# EAGLE design Design (EAGLE 9.6.2)
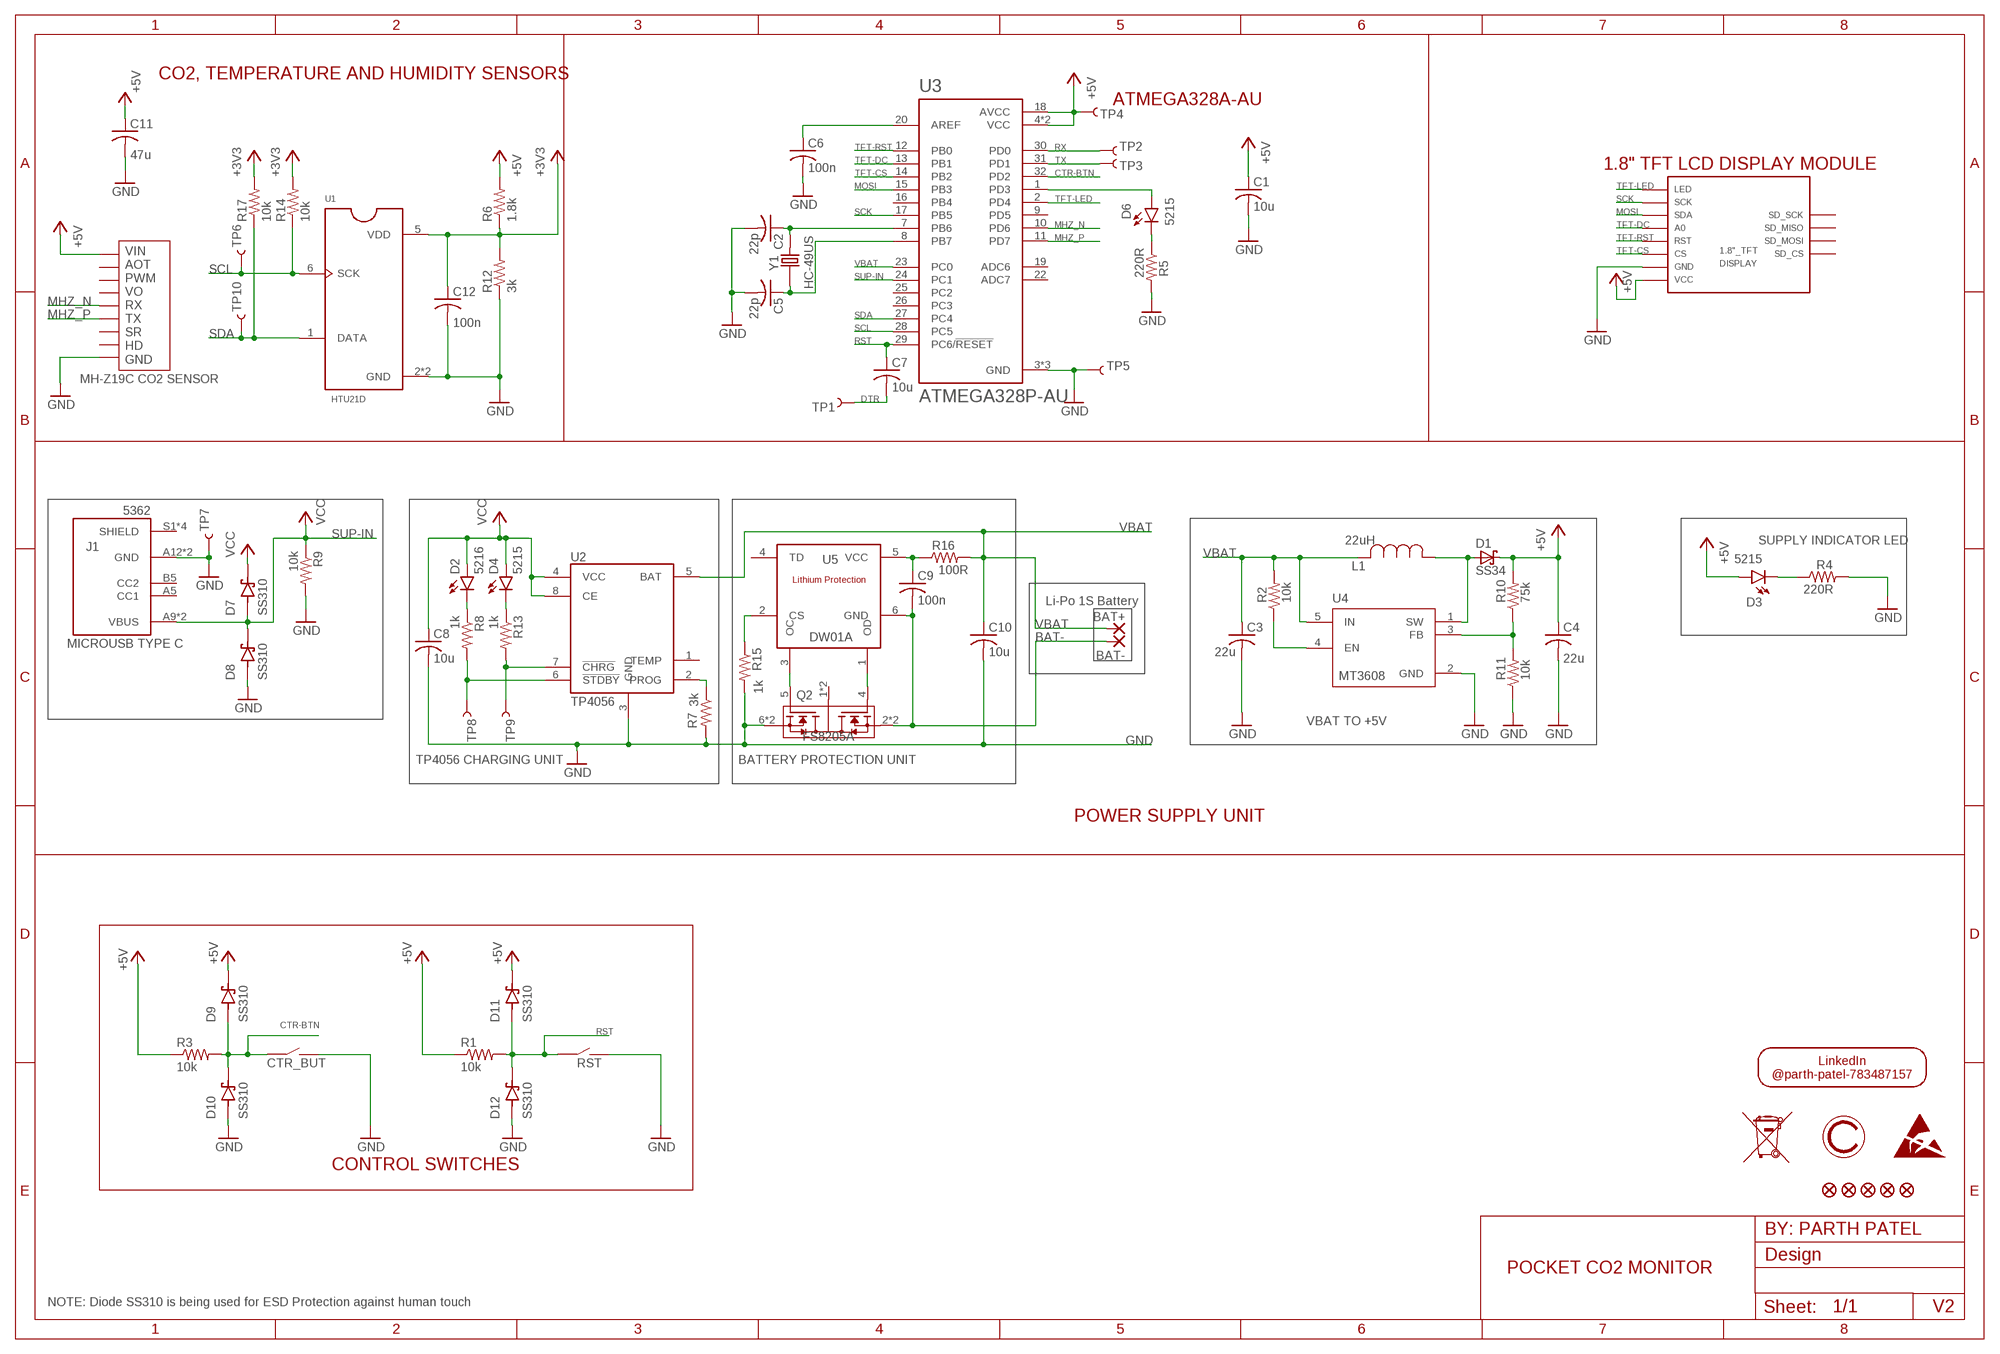
[diagram p0: schematic, sheet 1]

## Parts
BAT+  WIREPADSMD5-2,5  [5-2,5]
BAT-  WIREPADSMD5-2,5  [5-2,5]
C1  10u  C-USC0805  [C0805]
C2  22p  C-USC0805  [C0805]
C3  22u  C-USC0805  [C0805]
C4  22u  C-USC0805  [C0805]
C5  22p  C-USC0805  [C0805]
C6  100n  C-USC0805  [C0805]
C7  10u  C-USC0805  [C0805]
C8  10u  C-USC0805  [C0805]
C9  100n  C-USC0805  [C0805]
C10  10u  C-USC0805  [C0805]
C11  47u  C-USC0805  [C0805]
C12  100n  C-USC0805  [C0805]
CTR_BUT  7058  DIP_3X6MM_SIDE_PRESS_2PIN  [DIP_3X6MM_SIDE_PRESS_2PIN]
D1  SS34  [DO214]
D2  5216  LEDCHIP-LED0603  [CHIP-LED0603]
D3  5215  LEDCHIP-LED0603  [CHIP-LED0603]
D4  5215  LEDCHIP-LED0603  [CHIP-LED0603]
D6  5215  LEDCHIP-LED0603  [CHIP-LED0603]
D7  SS310  [DIOM6859X262N]
D8  SS310  [DIOM6859X262N]
D9  SS310  [DIOM6859X262N]
D10  SS310  [DIOM6859X262N]
D11  SS310  [DIOM6859X262N]
D12  SS310  [DIOM6859X262N]
DISPLAY  1.8"_TFT  [1.8"_TFT]
FID1  FIDUCIAL""  [FIDUCIAL_1MM]
FID2  FIDUCIAL""  [FIDUCIAL_1MM]
FID3  FIDUCIAL""  [FIDUCIAL_1MM]
FID4  FIDUCIAL""  [FIDUCIAL_1MM]
FID5  FIDUCIAL""  [FIDUCIAL_1MM]
J1  5362  6_PIN_TYPE_C_FEMALE  [GCT_USB4125-GF-A-0190_REVA2]
L1  22uH  DR127-221-R  [INDM125125X800N]
Q2  FS8205A  [SOP65P640X120-8N]
R1  10k  R-US_R0805  [R0805]
R2  10k  R-US_R0805  [R0805]
R3  10k  R-US_R0805  [R0805]
R4  220R  R-US_R0805  [R0805]
R5  220R  R-US_R0805  [R0805]
R6  1.8k  R-US_R0805  [R0805]
R7  3k  R-US_R0805  [R0805]
R8  1k  R-US_R0805  [R0805]
R9  10k  R-US_R0805  [R0805]
R10  75k  R-US_R0805  [R0805]
R11  10k  R-US_R0805  [R0805]
R12  3k  R-US_R0805  [R0805]
R13  1k  R-US_R0805  [R0805]
R14  10k  R-US_R0805  [R0805]
R15  1k  R-US_R0805  [R0805]
R16  100R  R-US_R0805  [R0805]
R17  10k  R-US_R0805  [R0805]
RST  7058  DIP_3X6MM_SIDE_PRESS_2PIN  [DIP_3X6MM_SIDE_PRESS_2PIN]
TP1  TEST-POINT3  [PAD.03X.03]
TP2  TEST-POINT3  [PAD.03X.03]
TP3  TEST-POINT3  [PAD.03X.03]
TP4  TEST-POINT3  [PAD.03X.03]
TP5  TEST-POINT3  [PAD.03X.03]
TP6  TEST-POINT3  [PAD.03X.03]
TP7  TEST-POINT3  [PAD.03X.03]
TP8  ~STDBY  TEST-POINT3  [PAD.03X.03]
TP9  ~CHRG  TEST-POINT3  [PAD.03X.03]
TP10  TEST-POINT3  [PAD.03X.03]
U1  HTU21D  [QFN100P300X300X100-7N]
U2  TP4056  [SOP127P600X175-9N]
U3  ATMEGA328P-AU  [QFP80P900X900X120-32N]
U4  MT3608  [SOT95P280X145-6N]
U5  DW01A  [SOT23-6]
U$1  LOGO_17MM  [FOOTPRINT_17MM]
U$2  MH-Z19C  [MH-Z19C]
Y1  HC-49US  ECS-160-20-4X  [XTAL_ECS-160-20-4X]

## Nets
+3V3: C12.1 R6.1 R12.2 R14.2 R17.2 U1.5(VDD)
+5V: C1.1 C4.1 C11.1 D1.C D3.A D9.C(K) D11.C(K) DISPLAY.VCC(+5V) R1.1 R3.1 R6.2 R10.2 TP4.P$1 U3.4(VCC) U3.6(VCC) U3.18(AVCC) U$2.VIN
BAT-: BAT-.1(P) C9.2 Q2.2(S1) Q2.3(S1) U5.6(GND)
CTR-BTN: CTR_BUT.P$1(S1) D9.A D10.C(K) R3.2 U3.32(PD2)
DTR: C7.2 TP1.P$1
GND: C1.2 C2.2 C3.2 C4.2 C5.2 C6.2 C8.2 C10.2 C11.2 C12.2 CTR_BUT.P$2(S2) D8.A D10.A D12.A DISPLAY.GND J1.A12(GND) J1.B12(GND) Q2.6(S2) Q2.7(S2) R4.2 R5.2 R7.2 R9.2 R11.1 R12.1 R15.2 RST.P$2(S2) TP5.P$1 TP7.P$1 U1.2(GND) U1.PAD(GND) U2.3(GND) U3.3(GND) U3.5(GND) U3.21(GND) U4.2(GND) U$2.GND
MHZ_N: U3.10(PD6) U$2.RX
MHZ_P: U3.11(PD7) U$2.TX
MOSI: DISPLAY.SDA U3.15(PB3)
N$2: C5.1 U3.8(PB7) Y1.1
N$3: D3.C R4.1
N$5: R2.1 U4.4(EN)
N$6: C6.1 U3.20(AREF)
N$8: D4.C R13.1
N$9: D2.C R8.1
N$10: C2.1 U3.7(PB6) Y1.2
N$11: D1.A L1.1 U4.1(SW)
N$12: R10.1 R11.2 U4.3(FB)
N$13: D6.C R5.1
N$14: D6.A U3.1(PD3)
N$15: Q2.5(G2) U5.3(OC)
N$16: R13.2 TP9.P$1 U2.7(!CHRG)
N$17: R8.2 TP8.P$1 U2.6(!STDBY)
N$18: R7.1 U2.2(PROG)
N$19: Q2.4(G1) U5.1(OD)
N$20: R15.1 U5.2(CS)
N$21: C9.1 R16.1 U5.5(VCC)
RST: C7.1 D11.A D12.C(K) R1.2 RST.P$1(S1) U3.29(PC6/!RESET)
RX: TP2.P$1 U3.30(PD0)
SCK: DISPLAY.SCK U3.17(PB5)
SCL: R14.1 TP6.P$1 U1.6(SCK) U3.28(PC5)
SDA: R17.1 TP10.P$1 U1.1(DATA) U3.27(PC4)
SUP-IN: D7.A D8.C(K) J1.A9(VBUS) J1.B9(VBUS) R9.1 U3.24(PC1) ; supply symbol labelled VCC
TFT-CS: DISPLAY.CS U3.14(PB2)
TFT-DC: DISPLAY.DC(A0) U3.13(PB1)
TFT-LED: DISPLAY.LED U3.2(PD4)
TFT-RST: DISPLAY.RST U3.12(PB0)
TX: TP3.P$1 U3.31(PD1)
VBAT: BAT+.1(P) C3.1 C10.1 L1.2 R2.2 R16.2 U2.5(BAT) U3.23(PC0) U4.5(IN)
VCC: C8.1 D2.A D4.A D7.C(K) U2.4(VCC) U2.8(CE)
Unconnected: DISPLAY.SD_CS DISPLAY.SD_MISO DISPLAY.SD_MOSI DISPLAY.SD_SCK J1.A5(CC1) J1.B5(CC2) J1.S1(SHIELD) J1.S2(SHIELD) J1.S3(SHIELD) J1.S4(SHIELD) Q2.1(D12) Q2.8(D12) U2.1(TEMP) U3.9(PD5) U3.16(PB4) U3.19(ADC6) U3.22(ADC7) U3.25(PC2) U3.26(PC3) U5.4(TD) U$2.AOT U$2.HD U$2.PWM U$2.SR U$2.VO

## Notes on the sheet
- CO2, TEMPERATURE AND HUMIDITY SENSORS
- ATMEGA328A-AU
- 1.8" TFT LCD DISPLAY MODULE
- SUPPLY INDICATOR LED
- Li-Po 1S Battery
- MICROUSB TYPE C
- VBAT TO +5V
- TP4056 CHARGING UNIT | BATTERY PROTECTION UNIT
- POWER SUPPLY UNIT
- CONTROL SWITCHES
- BY: PARTH PATEL
- POCKET CO2 MONITOR
- NOTE: Diode SS310 is being used for ESD Protection against human touch
- V2

## Library data of the parts
BAT+ BAT- = wirepad:WIREPAD: Wire PAD connect wire on PCB
C1-C12 = rcl:C-US: CAPACITOR, American symbol; SPICEPREFIX: C
CTR_BUT RST = Switches:DIP_3X6MM_SIDE_PRESS_2PIN
D1 = SS34:SS34: SS34 Schottky diode http://www.vishay.com/docs/88751/ss32.pdf Check availability <https://pricing.snapeda.com/parts/SS34/ON%20Semiconductor/view-part?ref=eda>; AVAILABILITY: In Stock; DESCRIPTION: Diode Schottky 40 V 3A Surface Mount SMC (DO-214AB); MF: ON Semiconductor; MP: SS34; PACKAGE: SMC-2 ON Semiconductor; PRICE: None; PURCHASE-URL: https://pricing.snapeda.com/search/part/SS34/?ref=eda
D2-D4 D6 = led:LED: LED OSRAM: - CHIPLED LG R971, LG N971, LY N971, LG Q971, LY Q971, LO R971, LY R971 LH N974, LH R974 LS Q976, LO Q976, LY Q976 LO Q996 - Hyper CHIPLED LW Q18S LB Q993, LB Q99A, LB R99A - SideLED LS A670, LO A670, LY A670, LG A670, LP A670 LB A673, LV A673, LT A673, LW A673 LH A674 LY A675 LS A676, LA A676, LO A676, LY A676, LW A676 LS A679, LY A679, LG A679 - Hyper Micro SIDELED® LS Y876, LA Y876, LO Y876, LY Y876 LT Y87S - SmartLED LW L88C, LW L88S LB L89C, LB L89S, LG L890 LS L89K, LO L89K, LY L89K LS L896, LA L896, LO L896, LY L896 - TOPLED LS T670, LO T670, LY T670, LG T670, LP T670 LSG T670, LSP T670, LSY T670, LOP T670, LYG T670 LG T671, LOG T671, LSG T671 LB T673, LV T673, LT T673, LW T673 LH T674 LS T676, LA T676, LO T676, LY T676, LB T676, LH T676, LSB T676, LW T676 LB T67C, LV T67C, LT T67C, LS T67K, LO T67K, LY T67K, LW E67C LS E67B, LA E67B, LO E67B, LY E67B, LB E67C, LV E67C, LT E67C LW T67C LS T679, LY T679, LG T679 LS T770, LO T770, LY T770, LG T770, LP T770 LB T773, LV T773, LT T773, LW T773 LH T774 LS E675, LA E675, LY E675, LS T675 LS T776, LA T776, LO T776, LY T776, LB T776 LHGB T686 LT T68C, LB T68C - Hyper Mini TOPLED® LB M676 - Mini TOPLED Santana® LG M470 LS M47K, LO M47K, LY M47K Source: http://www.osram.convergy.de LUXEON: - LUMILED® LXK2-PW12-R00, LXK2-PW12-S00, LXK2-PW14-U00, LXK2-PW14-V00 LXK2-PM12-R00, LXK2-PM12-S00, LXK2-PM14-U00 LXK2-PE12-Q00, LXK2-PE12-R00, LXK2-PE12-S00, LXK2-PE14-T00, LXK2-PE14-U00 LXK2-PB12-K00, LXK2-PB12-L00, LXK2-PB12-M00, LXK2-PB14-N00, LXK2-PB14-P00, LXK2-PB14-Q00 LXK2-PR12-L00, LXK2-PR12-M00, LXK2-PR14-Q00, LXK2-PR14-R00 LXK2-PD12-Q00, LXK2-PD12-R00, LXK2-PD12-S00 LXK2-PH12-R00, LXK2-PH12-S00 LXK2-PL12-P00, LXK2-PL12-Q00, LXK2-PL12-R00 Source: www.luxeon.com KINGBRIGHT: KA-3528ASYC Source: www.kingbright.com
D7-D12 = Schottky SS310:SS310: Check availability <https://pricing.snapeda.com/parts/SS310/Taiwan%20Semiconductor/view-part?ref=eda>; AVAILABILITY: In Stock; DESCRIPTION: 3A, 100V, Schottky Rectifier; MF: Taiwan Semiconductor; MP: SS310; PACKAGE: SMC-2 Taiwan Semiconductor; PRICE: None; PURCHASE-URL: https://pricing.snapeda.com/search/part/SS310/?ref=eda
DISPLAY = TFT & OLED Display:1.8"_TFT
FID1-FID5 = Airquality_Sensor:FIDUCIAL: Fiducial Alignment Points Various fiducial points for machine vision alignment.; BOM: EXCLUDE
J1 = MicroUSB Type C Socket:6_PIN_TYPE_C_FEMALE: Check availability <https://pricing.snapeda.com/parts/USB4125-GF-A-0190/Global%20Connector%20Technology/view-part?ref=eda>; AVAILABILITY: In Stock; DESCRIPTION: USB-C (USB TYPE-C) USB 2.0 Receptacle Connector 24 (6+18 Dummy) Position Surface Mount, Right Angle; Through Hole; MF: Global Connector Technology; MP: USB4125-GF-A-0190; PACKAGE: None; PRICE: None; PURCHASE-URL: https://pricing.snapeda.com/search/part/USB4125-GF-A-0190/?ref=eda
L1 = SMD 12mm Inductor:DR127-221-R: POWER INDUCTOR Check availability <https://pricing.snapeda.com/parts/DR127-221-R/Eaton/view-part?ref=eda>; AVAILABILITY: In Stock; DESCRIPTION: Inductor Power Shielded Drum Core 221.5uH/220uH 20% 100KHz Ferrite 1.29A 376mOhm DCR T/R; MF: Eaton; MP: DR127-221-R; PACKAGE: Nonstandard Eaton; PRICE: None; PURCHASE-URL: https://pricing.snapeda.com/search/part/DR127-221-R/?ref=eda
Q2 = FS8205A:FS8205A: N/A Check availability <https://pricing.snapeda.com/parts/FS8205A/Fortune%20Semiconductor/view-part?ref=eda>; AVAILABILITY: Not in stock; MF: Fortune Semiconductor; MP: FS8205A; PACKAGE: Package; PRICE: None
R1-R17 = rcl:R-US_: RESISTOR, American symbol; SPICEPREFIX: R
TP1-TP10 = SparkFun-Connectors:TEST-POINT: SparkFun Test Points Bare copper test points for troubleshooting or In-Circuit-Testing. These are used by our Production team for verifying production board runs using pogo-pins on test beds. SparkFun Products: SparkFun LSM9DS1 Breakout <https://www.sparkfun.com/products/13284> SparkFun PSOC <https://www.sparkfun.com/products/13714> SparkFun Load Cell Amplifier <https://www.sparkfun.com/products/13879>
U1 = HTU21D:HTU21D: Digital Relative Humidity sensor with Temperature output Check availability <https://pricing.snapeda.com/parts/HTU21D/TE%20Connectivity/view-part?ref=eda>; AVAILABILITY: In Stock; COMMENT: CAT-HSC0004; DESCRIPTION: HTU21D Humidity, Temperature Sensor Xplained Pro Platform Evaluation Expansion Board; MF: TE Connectivity; MP: HTU21D; PACKAGE: DFN-6 TE Connectivity; PRICE: None; PURCHASE-URL: https://pricing.snapeda.com/search/part/HTU21D/?ref=eda
U2 = TP4056:TP4056: Complete single cell Li-Ion battery with a constant current / constant voltage linear charger Check availability <https://pricing.snapeda.com/parts/TP4056/NanJing%20Top%20Power%20ASIC%20Corp./view-part?ref=eda>; AVAILABILITY: Not in stock; DESCRIPTION: Complete single cell Li-Ion battery with a constant current / constant voltage linear charger; MF: NanJing Top Power ASIC Corp.; MP: TP4056; PACKAGE: None; PRICE: None
U3 = ATMEGA328P-AU:ATMEGA328P-AU: ATmega Series 20 MHz 32 KB Flash 2 KB SRAM 8-Bit Microcontroller - TQFP-32 Check availability <https://pricing.snapeda.com/parts/ATMEGA328P-AU/Microchip%20Technology/view-part?ref=eda>; AVAILABILITY: In Stock; DESCRIPTION: AVR AVR® ATmega Microcontroller IC 8-Bit 20MHz 32KB (16K x 16) FLASH 32-TQFP (7x7); MF: Microchip Technology; MP: ATMEGA328P-AU; PACKAGE: TQFP-32 Microchip; PRICE: None; PURCHASE-URL: https://pricing.snapeda.com/search/part/ATMEGA328P-AU/?ref=eda
U4 = MT3608:MT3608: High Efficiency 1.2MHz 2A Step Up Converter Check availability <https://pricing.snapeda.com/parts/MT3608/Aerosemi%20Technology%20Co.%2C%20Ltd/view-part?ref=eda>; AVAILABILITY: Not in stock; DESCRIPTION: High Efficiency 1.2MHz 2A Step Up Converter; MF: Aerosemi Technology Co., Ltd; MP: MT3608; PACKAGE: Package; PRICE: None
U5 = DW01A:DW01A: Check availability <https://pricing.snapeda.com/parts/DW01A/Fortune%20Semiconductor/view-part?ref=eda>; AVAILABILITY: Not in stock; DESCRIPTION: One Cell Lithium-ion/Polymer Battery Protection IC; MF: Fortune Semiconductor; MP: DW01A; PACKAGE: SOT-23-6 Fortune Semiconductor; PRICE: None
U$1 = PCB Logo:LOGO_17MM
U$2 = MH-Z19 Sensor:MH-Z19C
Y1 = 16 MHz Crystal:ECS-160-20-4X: CRYSTAL T/H Check availability <https://pricing.snapeda.com/parts/ECS-160-20-4X/ECS%20Inc./view-part?ref=eda>; AVAILABILITY: In Stock; DESCRIPTION: 16 MHz ±30ppm Crystal 20pF 40 Ohms HC-49/US; MF: ECS Inc.; MP: ECS-160-20-4X; PACKAGE: HC-49US ECS Inc.; PRICE: None; PURCHASE-URL: https://pricing.snapeda.com/search/part/ECS-160-20-4X/?ref=eda

## Board
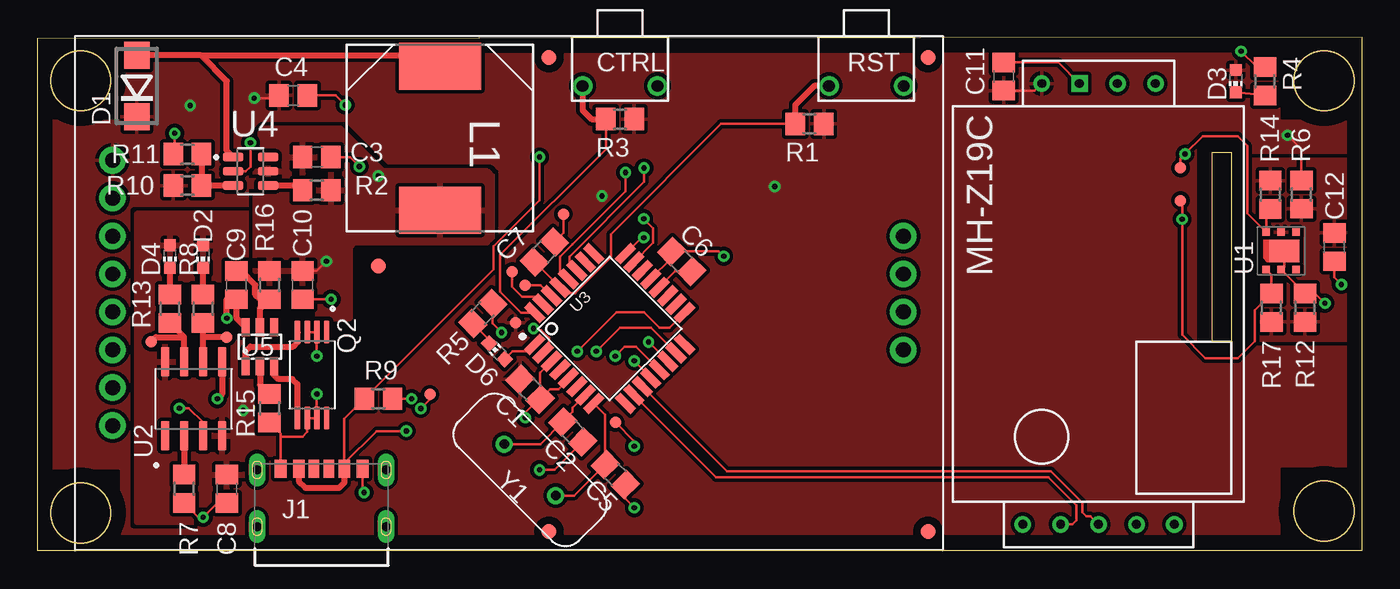
[diagram p1: board, top side]
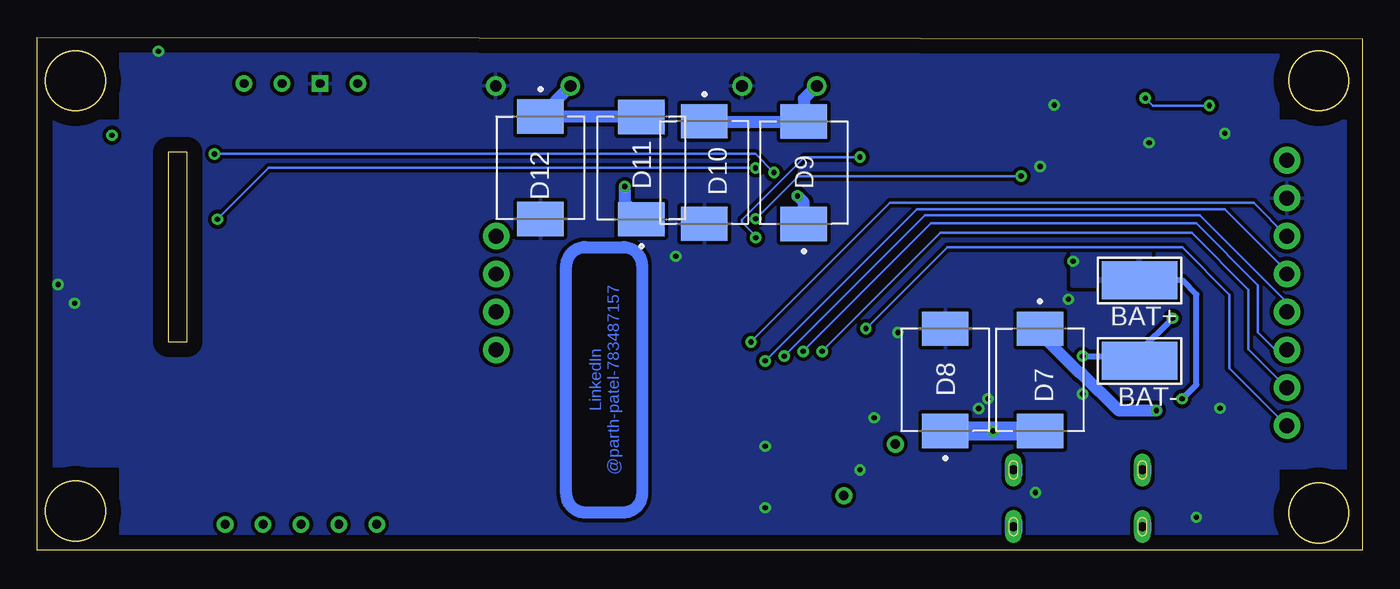
[diagram p2: board, bottom side, seen from below]

Size 88.79 x 34.38 mm. Coordinates in mm from the lower left corner, seen from the top.
Outline: 0,0 88.79,0 88.79,34.38 0,34.29 0,0
Outline: 80.01,26.67 80.01,13.97 78.74,13.97 78.74,26.67 80.01,26.67
Outline: circle at 86.23,31.47 radius 2
Outline: circle at 2.92,31.47 radius 2
Outline: circle at 2.92,2.51 radius 2
Outline: circle at 86.23,2.64 radius 2
Copper layers (1*16): Top 0.035mm / dielectric 1.5mm / Bottom 0.035mm
Design rules "default": minimum track width 6mil, minimum drill 0.35mm, track to track 0.25mm, track to pad 6mil, pad to pad 6mil, via to via 6mil, smd to smd 6mil, copper to edge 40mil, drill to drill 6mil, minimum pad ring 10mil, minimum via ring 8mil, stop-mask expansion 4mil, vias tented up to drill 15mil, thermal gap 10mil
tRestrict: area 83.4,28.9 to 88.8,34.3; area 0.1,28.9 to 5.4,34.3; area 0.1,0 to 5.4,5.3; area 83.4,0.1 to 88.8,5.5
bRestrict: area 83.4,28.9 to 88.8,34.3; area 0.1,28.9 to 5.4,34.3; area 0.1,0 to 5.4,5.3; area 83.4,0.1 to 88.8,5.5

### Footprints (pad centres in the part's own frame; a part is rotated, then mirrored left to right if it is on the bottom)
5-2,5 = smd 2.54 x 5.08: 1 0,0
C0805 = smd 1.3 x 1.5: 1 -0.95,0; 2 0.95,0
DIP_3X6MM_SIDE_PRESS_2PIN = drill 0.8: P$1 2.5,0; P$2 -2.5,0
DO214 = smd 1.8 x 1.7: A 2.05,0; C -2.05,0
CHIP-LED0603 = smd 0.8 x 0.8: A 0,-0.75; C 0,0.75
DIOM6859X262N = smd 2.29 x 3.12: A 3.43,0; C -3.43,0
1.8"_TFT = drill 1 pad 1.778: CS 2.5,21.06; DC 2.5,15.98; GND 2.5,23.6; LED 2.5,8.36; RST 2.5,18.52; SCK 2.5,10.9; SD_CS 55.5,21.05; SD_MISO 55.5,15.98; SD_MOSI 55.5,18.52; SD_SCK 55.5,13.44; SDA 2.5,13.44; VCC 2.5,26.14
FIDUCIAL_1MM = smd 1 x 1: 1 0,0
GCT_USB4125-GF-A-0190_REVA2 = smd 0.7 x 1.2: A5 -0.5,3.08; B5 0.5,3.08 | smd 0.76 x 1.2: A9 1.52,3.08; B9 -1.52,3.08 | smd 0.8 x 1.2: A12 2.75,3.08; B12 -2.75,3.08 | drill 0.6 pad 0.8 long: S1 -4.32,3; S2 4.32,3; S3 -4.32,-0.8; S4 4.32,-0.8
INDM125125X800N = smd 3.15 x 5.512: 1 -4.826,0; 2 4.826,0
SOP65P640X120-8N = smd 1.56 x 0.4: 1 -2.88,0.975; 2 -2.88,0.325; 3 -2.88,-0.325; 4 -2.88,-0.975; 5 2.88,-0.975; 6 2.88,-0.325; 7 2.88,0.325; 8 2.88,0.975
R0805 = smd 1.3 x 1.5: 1 -0.95,0; 2 0.95,0
PAD.03X.03 = smd 0.762 x 0.762: P$1 0,0
QFN100P300X300X100-7N = smd 0.5 x 0.5: 1 -1.25,1; 2 -1.25,0; 3 -1.25,-1; 4 1.25,-1; 5 1.25,0; 6 1.25,1 | smd 1.5 x 2: PAD 0,-0.2
SOP127P600X175-9N = smd 1.97 x 0.6: 1 -2.475,1.905; 2 -2.475,0.635; 3 -2.475,-0.635; 4 -2.475,-1.905; 5 2.475,-1.905; 6 2.475,-0.635; 7 2.475,0.635; 8 2.475,1.905
QFP80P900X900X120-32N = smd 1.5 x 0.55: 1 -4.3,2.8; 2 -4.3,2; 3 -4.3,1.2; 4 -4.3,0.4; 5 -4.3,-0.4; 6 -4.3,-1.2; 7 -4.3,-2; 8 -4.3,-2.8; 17 4.3,-2.8; 18 4.3,-2; 19 4.3,-1.2; 20 4.3,-0.4; 21 4.3,0.4; 22 4.3,1.2; 23 4.3,2; 24 4.3,2.8 | smd 0.55 x 1.5: 9 -2.8,-4.3; 10 -2,-4.3; 11 -1.2,-4.3; 12 -0.4,-4.3; 13 0.4,-4.3; 14 1.2,-4.3; 15 2,-4.3; 16 2.8,-4.3; 25 2.8,4.3; 26 2,4.3; 27 1.2,4.3; 28 0.4,4.3; 29 -0.4,4.3; 30 -1.2,4.3; 31 -2,4.3; 32 -2.8,4.3
SOT95P280X145-6N = smd 1.37 x 0.59: 1 -1.17,0.95; 2 -1.17,0; 3 -1.17,-0.95; 4 1.17,-0.95; 5 1.17,0; 6 1.17,0.95
SOT23-6 = smd 0.55 x 1.2: 1 -0.95,-1.3; 2 0,-1.3; 3 0.95,-1.3; 4 0.95,1.3; 5 0,1.3; 6 -0.95,1.3
MH-Z19C = drill 0.6: AOT -14.77,1.27; HD 14.77,5.08; PWM -14.77,3.81; RX 14.77,-2.54; SR 14.77,2.54; TX 14.77,0; VIN -14.77,-3.81; VO 14.77,-5.08 | drill 0.6 square: GND -14.77,-1.27
XTAL_ECS-160-20-4X = drill 0.63 pad 1.03: 1 -2.44,0; 2 2.44,0

### Placement (x,y rotation side)
BAT+  14.92,18.1 90 bottom
BAT-  14.92,12.7 90 bottom
C1  33.02,10.79 315 top
C2  35.88,7.94 315 top
C3  18.73,26.35 0 top
C4  17.14,30.48 0 top
C5  38.73,5.08 315 top
C6  43.18,19.37 135 top
C7  33.97,20 45 top
C8  12.7,4.13 270 top
C9  13.34,17.78 270 top
C10  17.78,17.78 270 top
C11  64.77,31.75 90 top
C12  86.92,20.32 270 top
CTR_BUT  39.05,31.11 180 top
D1  6.67,31.11 90 top
D2  11.11,19.68 180 top
D3  80.31,31.43 180 top
D4  8.89,19.68 180 top
D6  30.8,13.34 45 top
D7  21.59,11.43 270 bottom
D8  27.94,11.43 90 bottom
D9  37.42,25.3 90 bottom
D10  44.09,25.32 270 bottom
D11  48.31,25.61 90 bottom
D12  55.07,25.64 270 bottom
DISPLAY  2.54,0 0 top
FID1  59.69,1.27 0 top
FID2  59.69,33.02 0 top
FID3  34.29,33.02 0 top
FID4  34.29,1.27 0 top
FID5  22.86,19.05 0 top
J1  19.05,2.39 0 top
L1  26.99,27.62 270 top
Q2  18.41,11.75 270 top
R1  51.75,28.57 180 top
R2  18.73,24.13 0 top
R3  39.05,28.89 180 top
R4  82.27,31.44 90 top
R5  29.84,15.88 45 top
R6  84.72,23.84 90 top
R7  9.84,4.13 270 top
R8  11.11,16.19 270 top
R9  22.86,10.16 0 top
R10  10.06,24.45 180 top
R11  10.06,26.55 0 top
R12  84.95,16.26 270 top
R13  8.89,16.19 270 top
R14  82.63,23.82 90 top
R15  15.56,9.53 270 top
R16  15.56,17.78 90 top
R17  82.71,16.26 270 top
RST  55.56,31.11 180 top
TP1  35.26,22.52 0 top
TP2  32.7,17.78 0 top
TP3  31.83,18.68 0 top
TP4  32.07,15.24 0 top
TP5  26.31,10.45 90 top
TP6  76.6,25.62 0 top
TP7  38.73,8.57 0 top
TP8  12.7,14.29 270 top
TP9  7.62,13.97 270 top
TP10  76.6,23.44 0 top
U1  83.36,20.07 90 top
U2  10.48,10.16 90 top
U3  38.35,14.87 45 top
U4  14.29,25.4 0 top
U5  14.92,13.65 0 top
U$1  50.8,11.43 90 bottom
U$2  71.12,16.51 270 top
Y1  33.02,5.4 135 top

### Tracks (layer width: path | path; a pad name or v marks a point on that pad's centre or on a via)
+3V3
  pour Top: 80.98,26.25 80.98,14.06 89.42,14.06 89.42,26.25
+5V  (via drill 0.35)
  Top 0.152: C4.1 16.02,30.3 v14.54,30.3 | R6.2 84.72,26.88 v83.79,27.81 | C11.1 66.83,30.8 U$2.VIN
  Bottom 0.152: v14.54,30.3 14.04,29.8 v10.24,29.8
  Bottom 0.813: D9.C 37.42,23.32 v37.85,23.75 | D11.C 49.41,23.29 v49.41,24.38
  pour Top (rank 6): -1.27,35.56 -1.27,-1.27 90.17,-1.27 90.17,35.56
BAT-  (via drill 0.35)
  Top 0.152: Q2.3 Q2.2 | Q2.2 v18.73,13.02
  Top 0.406: Q2.2 | v12.7,15.56 12.7,16.83 C9.2 13.34,15.59 U5.6
  Bottom 0.406: v18.73,13.02 15.24,13.02 BAT-.1 14.92,13.34 v12.7,15.56
CTR-BTN
  Top 0.152: U3.32 32.42,15.93 31.02,17.33 31.02,19.81 38.1,26.89 R3.2
  Top 0.406: CTR_BUT.P$1 36.55,29.49 37.15,28.89 R3.2
  Bottom 0.813: CTR_BUT.P$1 37.42,30.25 D9.A 44.06,28.73 D10.C
DTR
  Top 0.152: C7.2 35.26,21.29 TP1.P$1
GND  (via drill 0.35)
  Top 0.152: R9.2 v25.08,10.16 | TP5.P$1 26.31,10.12 v25.71,9.51 | C5.2 39.41,3.46 v40.01,2.86 | C2.2 34.68,5.4 v33.66,5.4 | 81.95,32.07 R4.2 81.72,32.39 v80.67,33.44 | R5.2 30.52,15.2 v31.11,14.61 | v32.7,8.89 32.7,9.21 33.62,10.12 C1.2 | C1.2 34.36,10.79 34.92,10.79 35.59,11.46 U3.5 | v21.91,3.88 21.8,3.98 J1.A12 | Q2.6 | Q2.6 Q2.7 v18.73,10.48 | C10.2 v19.68,16.83 | TP7.P$1 40.01,7.3 v40.01,6.99 | U3.21 42.51,19.59 C6.2 45.66,20.04 v46,19.7 | C3.2 20.95,26.35 v21.59,25.72 | C4.2 20,30.48 v20.64,29.84 | J1.B12 16.3,7.62 | 16.3,7.62 16.3,7.83 R15.2 | 16.3,7.62 17.78,7.62 18.1,7.94 Q2.6 | R11.1 9.21,26.65 v9.21,27.94 | U4.2 13.97,25.4 14.29,25.72 v14.29,27.3 | R7.2 10.8,2.22 v11.11,2.22 12.07,3.18 C8.2 | U2.3 11.11,8.57 10.16,9.53 v9.53,9.53 | C1.2 33.69,11.9 U3.3 | v86.29,16.56 85.64,17.21 R12.1 84.95,17.23 U1.2 83.56,19.02 U1.PAD | C12.2 86.92,18.29 v87.4,17.81 | C11.2 68.43,32.7 U$2.GND
  pour Bottom (rank 6): -2.54,36.83 -2.54,-2.54 91.44,-2.54 91.44,36.83
MHZ_N
  Top 0.152: U3.10 45.48,4.91 67.77,4.91 69.65,3.04 69.65,2.01 69.37,1.74 U$2.RX
MHZ_P
  Top 0.152: U3.11 46.21,5.31 67.94,5.31 70.05,3.2 70.05,2.55 70.31,2.29 70.57,2.29 U$2.TX
MOSI  (via drill 0.35)
  Top 0.152: v37.46,13.34 39.05,14.92 41.13,14.92 U3.15
  Bottom 0.152: DISPLAY.SDA 5.82,13.44 6.99,14.61 6.99,17.78 11.11,21.91 28.89,21.91 v37.46,13.34
N$2
  Top 0.152: Y1.1 35.98,3.67 C5.1 38.06,9.08 U3.8
N$3
  Top 0.152: R4.1 D3.C
N$5
  Top 0.406: U4.4 17.46,24.45 R2.1
N$6
  Top 0.152: U3.20 42.75,18.7 C6.1
N$8
  Top 0.406: R13.1 D4.C
N$9
  Top 0.406: R8.1 D2.C
N$10
  Top 0.152: Y1.2 33.72,7.12 C2.1 35.88,9.28 35.88,9.56 U3.7
N$11
  Top 0.406: D1.A 7.3,33.16 10.97,33.16 | 10.97,33.16 27.48,33.16 27.62,33.02 27.05,32.45 L1.1 | U4.1 12.7,26.77 12.7,31.43 10.97,33.16
N$12
  Top 0.406: U4.3 R10.1 R11.2
N$13
  Top 0.152: R5.1 30.27,14.11 D6.C
N$14
  Top 0.152: D6.A 31.86,13.34 32.86,13.34 U3.1
N$15
  Top 0.406: Q2.5 17.44,11.13 17.09,11.48 16.14,11.48 15.87,11.75 U5.3
N$16
  Top 0.406: 9.84,14.29 R13.2 | U2.7 9.84,14.29 | TP9.P$1 7.94,14.29 9.84,14.29
N$17
  Top 0.406: U2.6 11.11,14.29 | 11.11,14.29 R8.2 | TP8.P$1 11.11,14.29
N$18
  Top 0.406: U2.2 R7.1
N$19
  Top 0.406: U5.1 13.97,13.02 13.97,13.34 14.29,13.65 17.14,13.65 17.46,13.97 17.46,14.61 Q2.4
N$20
  Top 0.406: R15.1 14.92,11.11 U5.2
N$21
  Top 0.406: U5.5 14.92,16.2 R16.1 14.92,16.83 14.61,17.14 14.61,17.78 13.66,18.73 C9.1
RST
  Top 0.152: C7.1 33.32,19.33 U3.29 35.21,17.62 35.6,17.24 36.02,17.24 38.44,19.65 38.44,21.2 45.82,28.57 R1.2
  Top 0.406: R1.2 50.8,29.84 52.07,31.11 RST.P$1
  Bottom 0.813: D11.A 48.34,29.07 D12.C 55.07,29.1 RST.P$1
RX
  Top 0.152: U3.30 33.74,17.78 TP2.P$1
SCK  (via drill 0.35)
  Top 0.152: v36.2,13.34 38.82,15.96 40.66,15.96 41.7,14.92 42.37,14.92 U3.17
  Bottom 0.152: DISPLAY.SCK 7.62,13.48 7.62,17.46 11.43,21.27 28.26,21.27 v36.2,13.34
SCL  (via drill 0.35)
  Top 0.152: R14.1 82.36,22.59 U1.6 81.1,22.57 81.1,27.12 80.46,27.76 78.12,27.76 v76.92,26.56 76.6,26.25 TP6.P$1 | U3.28 35.04,18.75 35.04,19.69 35.86,20.51 39.41,24.06 v39.41,25.31
  Bottom 0.152: v76.92,26.56 40.66,26.56 v39.41,25.31
SDA  (via drill 0.35)
  Top 0.152: U1.1 82.71,18.46 R17.1 81.6,16.1 81.6,14.02 80.46,12.88 78.29,12.88 76.72,14.45 v76.72,22.19 76.72,23.32 TP10.P$1 | U3.27 35.66,19.25 35.66,19.69 40.66,24.69 v40.66,25.62
  Bottom 0.152: v40.66,25.62 73.28,25.62 v76.72,22.19
SUP-IN  (via drill 0.35)
  Top 0.152: R9.1 20.57,8.82 J1.A9 20.57,5.84 22.73,8 v24.73,8 | v33.66,26.35 33.66,23.45 30.57,20.37 30.57,18.82 R9.1 | v40.64,20.95 40.48,20.95 U3.24
  Top 0.406: J1.B9 17.53,4.65 17.98,4.2 20.22,4.2 20.57,4.55 J1.A9 | R9.1
  Bottom 0.152: v33.66,26.35 37.37,26.35 41.56,22.16 41.56,21.97 40.64,21.05 v40.64,20.95
  Bottom 1.27: D7.A v24.73,8 D8.C | D8.C 28.29,8 28.48,7.81 28.13,7.81 D8.C
TFT-CS  (via drill 0.35)
  Top 0.152: v40.96,13.97 U3.14
  Bottom 0.152: DISPLAY.CS 7.26,23.28 31.64,23.28 v40.96,13.97
TFT-DC  (via drill 0.35)
  Top 0.152: v38.73,13.02 39.37,13.65 40.13,13.65 U3.13
  Bottom 0.152: DISPLAY.DC 5.04,16.61 10.88,22.46 29.29,22.46 v38.73,13.02
TFT-LED  (via drill 0.35)
  Top 0.152: U3.2 33.9,13.34 34.29,13.73 34.29,14.24 33.76,14.76 33.36,14.76 v33.25,14.87
  Bottom 0.152: DISPLAY.LED 8.89,12.21 8.89,17.14 12.07,20.32 27.8,20.32 v33.25,14.87
TFT-RST  (via drill 0.35)
  Top 0.152: v40.01,12.7 41.11,11.6 U3.12
  Bottom 0.152: DISPLAY.RST 5.04,18.69 9.21,22.86 29.84,22.86 v40.01,12.7
TX
  Top 0.152: U3.31 33.4,16.99 32.5,16.99 31.83,17.66 TP3.P$1
VBAT  (via drill 0.35)
  Top 0.152: U3.23 41.27,20.62 41.27,21.59 v40.64,22.23 | C10.1 18.73,18.73 v19.37,19.37
  Top 0.406: U2.5 12.38,10.48 v12.07,10.16
  Bottom 0.152: v40.64,22.23 37.78,25.08 v22.86,25.08
  Bottom 0.406: v12.07,10.16 11.11,11.11 11.11,17.14 12.07,18.1 BAT+.1
  pour Bottom: 14.29,22.23 14.29,17.78 19.37,17.78 19.37,22.23
  pour Top: 14.61,15.88 14.92,15.56 20.95,15.56 20.95,20.32 21.27,20.64 30.16,20.64 30.48,20.95 30.48,25.08 30.16,25.4 23.18,25.4 20.32,28.26 15.24,28.26 14.61,27.62
VCC  (via drill 0.35)
  Bottom 0.813: D7.C 21.59,14.55 18.91,11.88 18.8,11.88 16.3,9.38 v13.79,9.38
  pour Top (rank 2): 6.67,1.91 20.64,1.91 20.64,22.54 6.67,22.54

### Text on the board
tNames: CTRL | RST